# EAGLE schematic gsmwattsmonitor (EAGLE 6.6.0)
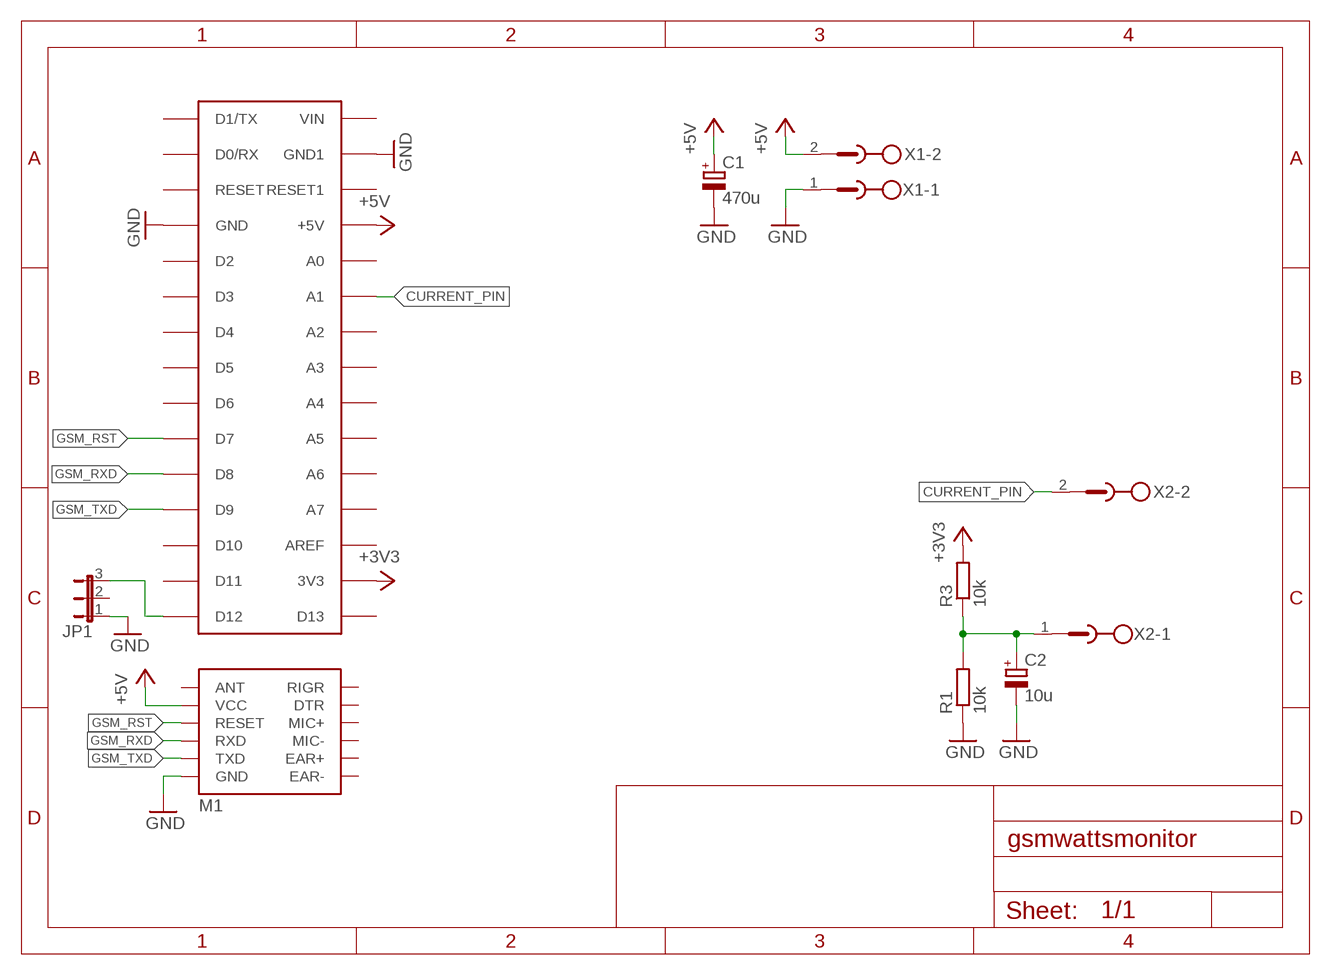
[diagram p0: schematic, sheet 1]

## Parts
C1  470u  CPOL-EUE2.5-6  [E2,5-6]
C2  10u  CPOL-EUE2-4  [E2-4]
JP1  JP2E  [JP2]
M1  SIM800L  [SIM800L]
R1  10k  R-EU_0204/7  [0204/7]
R3  10k  R-EU_0204/7  [0204/7]
U$1  ARDUINONANO  [PDIP-32]
X1  MSTBV2  [MSTBV2]
X2  MSTBV2  [MSTBV2]

## Nets
+3V3: R3.2 U$1.3V3
+5V: C1.+ M1.VCC U$1.+5V X1.2
CURRENT_PIN: U$1.A1 X2.2
GND: C1.- C2.- JP1.1 M1.GND R1.1 U$1.GND U$1.GND1 X1.1
GSM_RST: M1.RESET U$1.D7
GSM_RXD: M1.RXD U$1.D8
GSM_TXD: M1.TXD U$1.D9
N$1: C2.+ R1.2 R3.1 X2.1
N$2: JP1.3 U$1.D12
Unconnected: JP1.2 M1.ANT M1.DTR M1.EAR+ M1.EAR- M1.MIC+ M1.MIC- M1.RIGR U$1.A0 U$1.A2 U$1.A3 U$1.A4 U$1.A5 U$1.A6 U$1.A7 U$1.AREF U$1.D0/RX U$1.D1/TX U$1.D2 U$1.D3 U$1.D4 U$1.D5 U$1.D6 U$1.D10 U$1.D11 U$1.D13 U$1.RESET U$1.RESET1 U$1.VIN

## Library data of the parts
C1 C2 = rcl:CPOL-EU: POLARIZED CAPACITOR, European symbol
JP1 = jumper:JP2E: JUMPER
M1 = library:SIM800L
R1 R3 = rcl:R-EU_: RESISTOR, European symbol
U$1 = rocketfarm:ARDUINONANO
X1 X2 = con-phoenix-500:MSTBV2: PHOENIX; OC_FARNELL: unknown; OC_NEWARK: unknown